# Altium schematic sheet SH-C30G-V1.5.SchDoc
size 420 x 298 mm; Symbol: Sheet-Symbol_A3; Company: DSD TECH; @Page No: 1; @Page Name: P1; @Project Name: CANable; @Page Count: 1; @Update Date: 2023-04-11; @Create Date: 2023-04-11; @Schematic Name: CANableIsolate_V1.4; Device: Sheet-Symbol_A3; @Board Name: CANable_Isolated_SH-C30G_V1.4; @Create Time: 18:08:01; @Update Time: 18:43:36
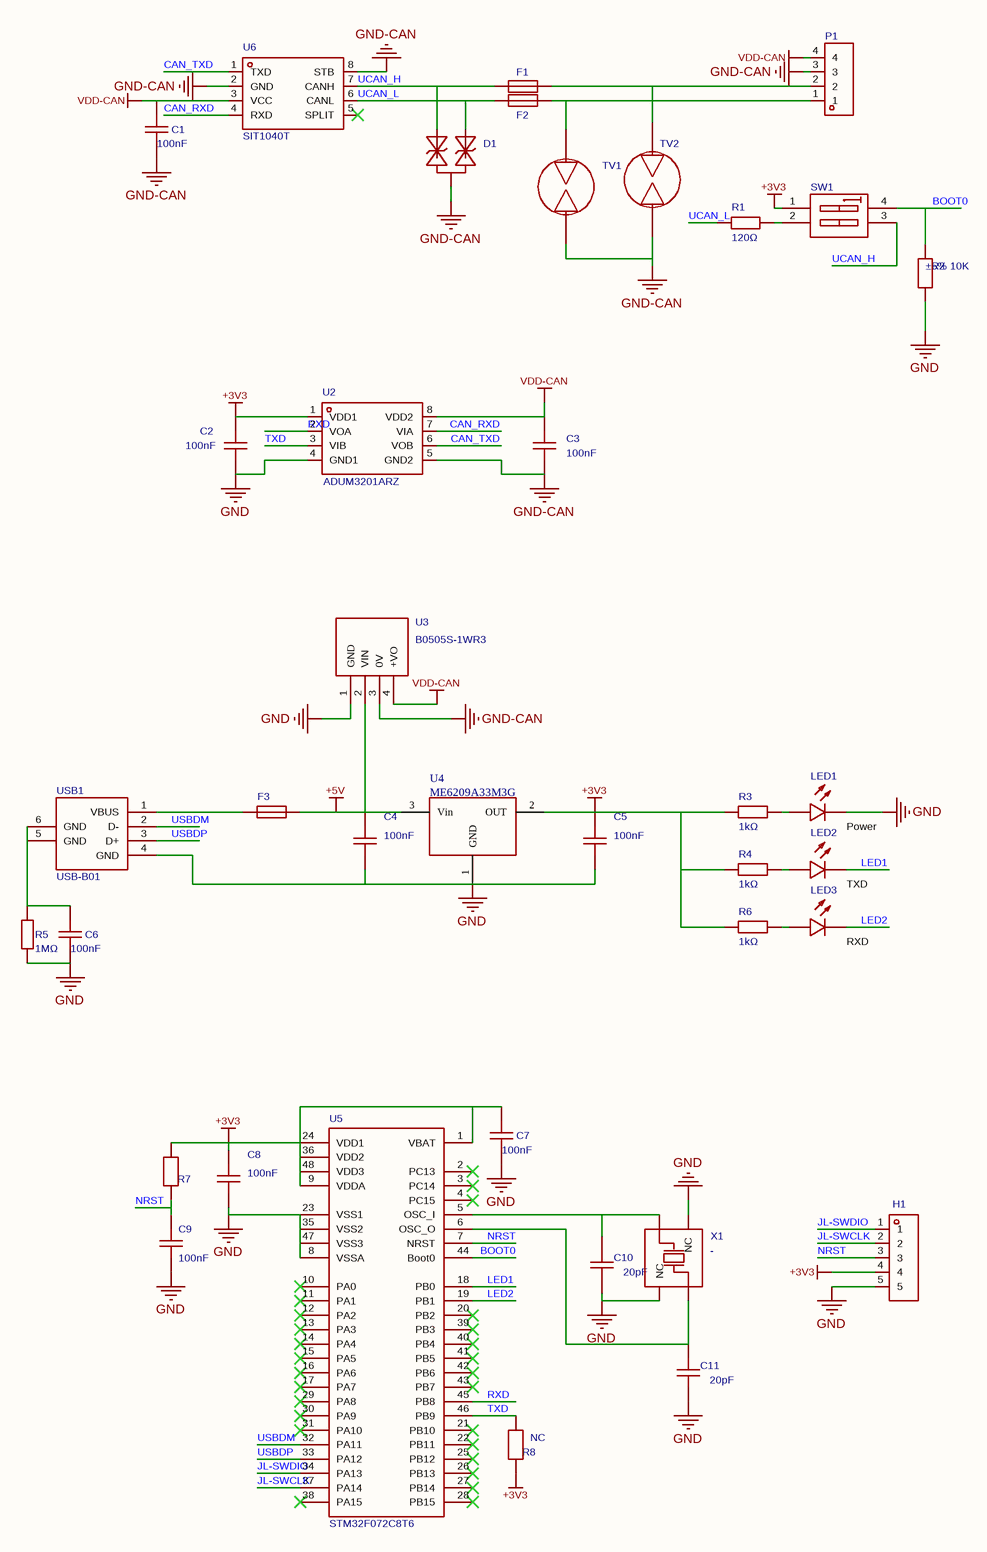
[diagram p0: SH-C30G-V1.5.SchDoc]

## Parts
C1  value 100nF  [C0402]
C2  value 100nF  [C0402]
C3  value 100nF  [C0402]
C4  value 100nF  [C0402]
C5  value 100nF  [C0402]
C6  value 100nF  [C0402]
C7  value 100nF  [C0402]
C8  value 100nF  [C0402]
C9  value 100nF  [C0402]
C10  value 20pF  [C0402]
C11  value 20pF  [C0402]
D1  (no value)  [SOT-23-3_L2.9-W1.3-P1.90-LS2.4-BR]
F1  SMD1206B020TF/24  [F1206_1]  (value not drawn)
F2  SMD1206B020TF/24  [F1206_1]  (value not drawn)
F3  SMD0805B050TF  [F0805_2]  (value not drawn)
H1  (no value)  [HDR-TH_5P-P2.54-V-M]
LED1  (no value)  [LED0603-RD_RED_1]
LED2  (no value)  [LED0603-RD]
LED3  (no value)  [LED0603-RD]
P1  WJ128V-5.0-4P  [CONN-TH_4P-P5.00_WJ128V-4P-5.0-14-00A]  (value not drawn)
R1  value 120Ω  [R0805]
R2  LCSC Part Name: ±5% 10K  [R0402]
R3  value 1kΩ  [R0402]
R4  value 1kΩ  [R0402]
R5  value 1MΩ  [R0603]
R6  value 1kΩ  [R0402]
R7  (no value)  [R0402]
R8  NC  [R0402]
SW1  DP-02RP  [SW-TH_DP-02XP]  (value not drawn)
TV1  (no value)  [DIO-DT-SMD_L4.5-W3.2]
TV2  (no value)  [DIO-DT-SMD_L4.5-W3.2]
U2  ADUM3201ARZ  [SOIC-8_L4.9-W3.9-P1.27-LS6.0-BL]
U3  Manufacturer Part: B0505S-1WR3  [PWRM-TH_B0503S-1WR2]  (hidden comment: B0505S-1WR3_C131038)
U4  ME6209A33M3G  [SOT-23(SOT-23-3)]
U5  (no value)  [LQFP-48_L7.0-W7.0-P0.50-LS9.0-BL]
U6  SIT1040T  [SO-8_L4.9-W3.9-P1.27-LS5.9-BL]
USB1  (no value)  [USB-B-TH_USB-B01]
X1  7V24000005  [CRYSTAL-SMD_4P-L3.2-W2.5-BL]  (value not drawn)

## Nets
+3V3: C2.2 C5.2 C7.2 C8.2 H1.4 R3.1 R4.1 R6.1 R7.2 R8.1 SW1.1(A1) U2.1(VDD1) U4.2(OUT) U5.1(VBAT) U5.9(VDDA) U5.24(VDD1) U5.36(VDD2) U5.48(VDD3)
+5V: C4.2 F3.2 U3.2(VIN) U4.3(Vin)
GND: C2.1 C4.1 C5.1 C6.1 C7.1 C8.1 C9.1 C10.2 C11.1 H1.5 LED1.1(K) R2.1 R5.1 U2.4(GND1) U3.1(GND) U4.1(GND) U5.8(VSSA) U5.23(VSS1) U5.35(VSS2) U5.47(VSS3) USB1.4(GND) X1.2(NC) X1.4(NC)
GND-CAN: C1.1 C3.1 D1.3 P1.3 TV1.2 TV2.2 U2.5(GND2) U3.3(0V) U6.2(GND) U6.8(STB)
VDD-CAN: C1.2 C3.2 P1.4 U2.8(VDD2) U3.4(+VO) U6.3(VCC)
BOOT0: R2.2 SW1.4 U5.44(Boot0)
CAN_RXD: U2.7(VIA) U6.4(RXD)
CAN_TXD: U2.6(VOB) U6.1(TXD)
JL-SWCLK: H1.2 U5.37(PA14)
JL-SWDIO: H1.1 U5.34(PA13)
LED1: LED2.1(K) U5.18(PB0)
LED2: LED3.1(K) U5.19(PB1)
NRST: C9.2 H1.3 R7.1 U5.7(NRST)
RXD: U2.2(VOA) U5.45(PB8)
TXD: R8.2 U2.3(VIB) U5.46(PB9)
UCAN_H: D1.2 F1.1 SW1.3 U6.7(CANH)
UCAN_L: D1.1 F2.1 R1.1 U6.6(CANL)
USBDM: U5.32(PA11) USB1.2(D-)
USBDP: U5.33(PA12) USB1.3(D+)
NetC6_2: C6.2 R5.2 USB1.5(GND) USB1.6(GND)
NetC10_1: C10.1 U5.5(OSC_I) X1.1(OSC1)
NetC11_2: C11.2 U5.6(OSC_O) X1.3(OSC2)
NetF1_2: F1.2 P1.2 TV2.1
NetF2_2: F2.2 P1.1 TV1.1
NetF3_1: F3.1 USB1.1(VBUS)
NetLED1_2: LED1.2(A) R3.2
NetLED2_2: LED2.2(A) R4.2
NetLED3_2: LED3.2(A) R6.2
NetR1_2: R1.2 SW1.2(A2)

Not connected (* = marked no-connect by the designer): U5 2(PC13)* 3(PC14)* 4(PC15)* 10(PA0)* 11(PA1)* 12(PA2)* 13(PA3)* 14(PA4)* 15(PA5)* 16(PA6)* 17(PA7)* 20(PB2)* 21(PB10)* 22(PB11)* 25(PB12)* 26(PB13)* 27(PB14)* 28(PB15)* 29(PA8)* 30(PA9)* 31(PA10)* 38(PA15)* 39(PB3)* 40(PB4)* 41(PB5)* 42(PB6)* 43(PB7)*; U6 5(SPLIT)*

## Notes on the sheet
- (near LED1) Power
- (near LED2) TXD
- (near LED3) RXD
- Update Date
- 2023-04-11
- Schematic
- Page
- P1
- CANableIsolate_V1.4
- Create Date
- Part Number
- Reviewed
- Drawed
- CANable
- VER
- SIZE
- PAGE
- 1
- DSD TECH
- OF

## Library data of the parts
C1-C9 = C0402X104K050T: Capacitance:100nF;Tolerance:±10%;Rated Voltage:50V;Temp. Coefficient:X7R;; Manufacturer: IHHEC; AddInBom: yes; ModelId: 36a51122f27c49738f86b3bfa98863e0; ModelName: C0402_L1.0-W0.5-H0.5; ModelTransform: 39.37,19.685,0,0,0,0,0,0,0; Tolerance: ±10%; Voltage Rated: 50V; Temperature Coefficient: X7R; Device: C0402X104K050T; Symbol: C0402X104K050T; LCSC Part Name: 100nF ±10% 50V; SupplierPart: C501838; ManufacturerPart: C0402X104K050T; Supplier Footprint: 0402; JLCPCB Part Class: Extended Part; Datasheet: https://atta.szlcsc.com/upload/public/pdf/source/20190313/C374174_331C86E4A68CC9C732DA87186AAF7F8A.pdf; Supplier: LCSC; ConvertToPcb: yes; FootprintName: C0402
C10 C11 = GRM1555C1H200JA01D: Capacitance:20pF;Tolerance:±5%;Rated Voltage:50V;Temp. Coefficient:C0G;; Manufacturer: muRata; AddInBom: yes; ModelId: 36a51122f27c49738f86b3bfa98863e0; ModelName: C0402_L1.0-W0.5-H0.5; ModelTransform: 39.37,19.685,0,0,0,0,0,0,0; Tolerance: ±5%; Voltage Rated: 50V; Temperature Coefficient: C0G; Device: GRM1555C1H200JA01D; Symbol: GRM1555C1H200JA01D; LCSC Part Name: 20pF ±5% 50V; SupplierPart: C76959; ManufacturerPart: GRM1555C1H200JA01D; Supplier Footprint: 0402; JLCPCB Part Class: Extended Part; Datasheet: https://atta.szlcsc.com/upload/public/pdf/source/20180307/C76959_15204091273971407747.pdf; Supplier: LCSC; ConvertToPcb: yes; FootprintName: C0402
D1 = TPPESD12VL2BT: Manufacturer: TECH PUBLIC; AddInBom: yes; ModelId: c62791f0466c4ae2a892c056b845b0ca; ModelName: SOT-23-3P_L2.9-W1.3-H1.0-LS2.4-P0.95; ModelTransform: 98.425,114.173,0,180,0,0,0.0005,-0.0005,0; Device: TPPESD12VL2BT; Symbol: TPPESD12VL2BT; LCSC Part Name: TPPESD12VL2BT; SupplierPart: C2682273; ManufacturerPart: TPPESD12VL2BT; Supplier Footprint: SOT-23-3; JLCPCB Part Class: Extended Part; Datasheet: https://atta.szlcsc.com/upload/public/pdf/source/20210810/22D0EE7AE03C1C968B9C50DDF599EB08.pdf; Supplier: LCSC; ConvertToPcb: yes; FootprintName: SOT-23-3_L2.9-W1.3-P1.90-LS2.4-BR
F1 F2 = SMD1206B020TF/24: Max Voltage:24V;Max Current:100A;Hold Current:200mA;Trip Current:420mA;Max Trip Time:100ms;; Manufacturer: Brightking; AddInBom: yes; ModelId: f1628daad26847a79b887277a2bc8541; ModelName: F1206_L3.2-W1.7-H0.6; ModelTransform: 125.984,66.929,0,0,0,0,0,0,0; Operating Voltage (Max): 24V; Current Rating (Max): 100A; Hold Current: 200mA; Trip Current: 420mA; Maximum Time to Trip: 100ms; Device: SMD1206B020TF/24; Symbol: SMD1206B020TF/24; LCSC Part Name: 24VDC 0.2A; SupplierPart: C269111; ManufacturerPart: SMD1206B020TF/24; Supplier Footprint: SMD; JLCPCB Part Class: Extended Part; Datasheet: https://atta.szlcsc.com/upload/public/pdf/source/20180817/C269111_B76553ADDD05C0EABB0A26C6D9A96E77.pdf; Supplier: LCSC; ConvertToPcb: yes; FootprintName: F1206_1
F3 = SMD0805B050TF: Max Voltage:6V;Max Current:100A;Hold Current:500mA;Trip Current:1A;Max Trip Time:100ms;; Manufacturer: Brightking; AddInBom: yes; ModelId: 57e2aa106f9143e8b6ab832aebb31c78; ModelName: F0805_L2.1-W1.4-H0.8; ModelTransform: 82.677,55.118,0,0,0,0,0.0005,0,0; Operating Voltage (Max): 6V; Current Rating (Max): 100A; Hold Current: 500mA; Trip Current: 1A; Maximum Time to Trip: 100ms; Device: SMD0805B050TF; Symbol: SMD0805B050TF; LCSC Part Name: 6V 0.5A; SupplierPart: C269104; ManufacturerPart: SMD0805B050TF; Supplier Footprint: 0805; JLCPCB Part Class: Extended Part; Datasheet: https://atta.szlcsc.com/upload/public/pdf/source/20180814/C269104_466839A5DB65F6E723CA6A162ACE747B.pdf; Supplier: LCSC; ConvertToPcb: yes; FootprintName: F0805_2
H1 = PZ254V-11-05P: Pitch:2.54mm;Total Pins:5;Rows:1;Pin Configuration:1x5P;Row Spacing:-;Mounting Type:Through Hole;Round Pin/Square Pin:Square Pin;Rated Current:-;Rated Voltage:-;Mating Pin Length:6mm;Insulator Height:2.5mm;Termination Pin Length:3mm;Contact Material:Brass;Contact Plating:-;Operating Temp. Range:-40~+105;Color:Black;; Manufacturer: XFCN; AddInBom: yes; ModelId: 47d466e4a34f4fc5bc626cf773a24dd5; ModelName: HDR-TH_5P-P2.54-M-LI-1X5P; ModelTransform: 499.999,100,0,0,0,0,0,0,-118.11; Pitch: 2.54mm; Pin Structure: 1x5P; Operating Temperature Range: -40~+105; Device: PZ254V-11-05P; Symbol: PZ254V-11-05P; LCSC Part Name: 2.54mm 1x5P; SupplierPart: C492404; ManufacturerPart: PZ254V-11-05P; Supplier Footprint: Through Hole,P=2.54mm; JLCPCB Part Class: Extended Part; Datasheet: https://atta.szlcsc.com/upload/public/pdf/source/20200309/C492404_E51533260F8710EFF5D4617281164C1D.pdf; Supplier: LCSC; ConvertToPcb: yes; FootprintName: HDR-TH_5P-P2.54-V-M; Number of Pins: 5; Number of Rows: 1; Row Spacing: -; Mounting Type: Through Hole; Circluar Pins/Square Pins: Square Pin; Current Rating (Max): -; Voltage Rating (Max): -; Length of Mating Pin: 6mm; Insulation Height: 2.5mm; Length of End Connection Pin: 3mm; Contact Material: Brass; Contact Plating: -; Color: Black
LED1 = NCD0603R1_C84263: Emitted Color:Red;; Manufacturer: NationStar; Symbol: FC-DA1608HRK-620D_1; AddInBom: yes; ModelId: 74041d3a270d435c8600a9ab9b7641c0; ModelName: LED0603-RD_RED; ModelTransform: 63.7794,31.496,0,0,0,0,0,0,0; Emitted Color: Red; Device: NCD0603R1_C84263; LCSC Part Name: Red; SupplierPart: C84263; ManufacturerPart: NCD0603R1; Supplier Footprint: 0603; JLCPCB Part Class: Extended Part; Datasheet: https://atta.szlcsc.com/upload/public/pdf/source/20200820/C84263_DABC6A75E58F576973B407FDBA283D60.pdf; Supplier: LCSC; ConvertToPcb: yes; FootprintName: LED0603-RD_RED_1
LED2 LED3 = NCD0603G1: Emitted Color:Emerald Green;; Manufacturer: NationStar; Symbol: FC-D1608UGK-520D10; AddInBom: yes; ModelId: 1f0d29a91be547639d425604e9b96ebb; ModelTransform: 63.7794,32.283,0,0,0,0,0,0,0; Device: NCD0603G1; LCSC Part Name: Emerald Green; SupplierPart: C84267; ManufacturerPart: NCD0603G1; Supplier Footprint: 0603; JLCPCB Part Class: Extended Part; Datasheet: https://atta.szlcsc.com/upload/public/pdf/source/20200820/C84267_04BA7703640BAC111D09F5EFB971FBF3.pdf; Supplier: LCSC; ConvertToPcb: yes; FootprintName: LED0603-RD; ModelName: LED0603-RD; Emitted Color: Emerald Green
P1 = WJ128V-5.0-4P: Pitch:5mm;Rows:1;Pins per Row:4;Mounting:Straight;Rated Current:20A;Rated Voltage:250V;Wire Gauge - AWG:12~22;Wire Gauge - mm?:2.5;Operating Temp. Range:-40℃~+105℃;Color:Green;; Manufacturer: KANGNEX; Symbol: WJ128V-4P-5.0-14-00A; AddInBom: yes; ModelId: cfcf1d8cbec746899afb5ab743e84074; ModelName: CONN-TH_WJ5.00-LI-4P-128; ModelTransform: 807.0748,405.511,0,0,0,0,-7.874,-5.315,-157.48; Pitch: 5mm; Number of PINs Per Row: 4; Current Rating (Max): 20A; Voltage Rating (Max): 250V; Wire Gauge - AWG: 12~22; Wire Gauge - mm?: 2.5; Device: WJ128V-5.0-4P; LCSC Part Name: 5mm Rows:1 Pins per Row:4 Straight stackable; SupplierPart: C192769; ManufacturerPart: WJ128V-5.0-4P; Supplier Footprint: Through Hole,P=5mm; JLCPCB Part Class: Extended Part; Datasheet: https://atta.szlcsc.com/upload/public/pdf/source/20191225/C192769_677B15EBBD9FD2D22E696A4E109D0907.pdf; Supplier: LCSC; ConvertToPcb: yes; FootprintName: CONN-TH_4P-P5.00_WJ128V-4P-5.0-14-00A; Number of Rows: 1; Mounting Style: Straight; Operating Temperature Range: -40℃~+105℃; Color: Green
R1 = TC0525F1200T5E: Resistor Type:Thin Film Resistor;Resistance:120Ω;Tolerance:±1%;Power:250mW;Temp. Coefficient:±25ppm/;Max Working Voltage:150V;Operating Temp. Range:-55~+155;; Manufacturer: UNI-ROYAL; Temperature Coefficient: ±25ppm/; AddInBom: yes; ModelId: 37a81e68749a4138bd2dfa6897b24b85; ModelName: R0805_L2.0-W1.3-H0.6; ModelTransform: 78.74,51.181,0,0,0,0,0,-0.0005,0; Tolerance: ±1%; Power(Watts): 250mW; Overload Voltage (Max): 150V; Operating Temperature Range: -55~+155; Device: TC0525F1200T5E; Symbol: TC0525F1200T5E; LCSC Part Name: 120Ω ±1%; SupplierPart: C61683; ManufacturerPart: TC0525F1200T5E; Supplier Footprint: 0805; JLCPCB Part Class: Extended Part; Datasheet: https://atta.szlcsc.com/upload/public/pdf/source/20190404/C61683_83EF7BF6E2DB2C00969A8D3769A56445.pdf; Supplier: LCSC; ConvertToPcb: yes; FootprintName: R0805; Type: Thin Film Resistor
R2 R7 R8 = SCR0402J10K: Manufacturer: VO; AddInBom: yes; ModelId: 671aefced39d4c318694bba8bd8efd39; ModelName: R0402_L1.0-W0.5-H0.5; ModelTransform: 39.37,19.685,0,0,0,0,0,0.0005,0; Device: SCR0402J10K; Symbol: SCR0402J10K; SupplierPart: C3017497; ManufacturerPart: SCR0402J10K; Supplier Footprint: 0402; JLCPCB Part Class: Extended Part; Datasheet: https://atta.szlcsc.com/upload/public/pdf/source/20220513/247AF9639BA21CF93567DC289CCC6A22.pdf; Supplier: LCSC; ConvertToPcb: yes; FootprintName: R0402
  R7 R8: LCSC Part Name: ±5% 10K
R3 R4 R6 = RC0402JR-071KL: Resistance:1kΩ;Tolerance:±5%;Power:1/16W;Temp. Coefficient:±100ppm/;Max Working Voltage:50V;Operating Temp. Range:-55~+155;; Manufacturer: YAGEO; AddInBom: yes; ModelId: 671aefced39d4c318694bba8bd8efd39; ModelName: R0402_L1.0-W0.5-H0.5; ModelTransform: 39.37,19.685,0,0,0,0,0,0.0005,0; Tolerance: ±5%; Power(Watts): 1/16W; Overload Voltage (Max): 50V; Device: RC0402JR-071KL; Temperature Coefficient: ±100ppm/; Operating Temperature Range: -55~+155; Symbol: RC0402JR-071KL; LCSC Part Name: 1kΩ ±5%; SupplierPart: C105637; ManufacturerPart: RC0402JR-071KL; Supplier Footprint: 0402; JLCPCB Part Class: Extended Part; Datasheet: https://atta.szlcsc.com/upload/public/pdf/source/20170518/1495085707603.pdf; Supplier: LCSC; ConvertToPcb: yes; FootprintName: R0402
R5 = 0603WAJ0105T5E: Resistor Type:Thick Film Resistor;Resistance:1MΩ;Tolerance:±5%;Power:1/10W;Temp. Coefficient:±100ppm/;Max Working Voltage:75V;Operating Temp. Range:-55~+155;; Manufacturer: UNI-ROYAL; AddInBom: yes; ModelId: 3281a289d46d4bb1877be1eabd090e13; ModelName: R0603_L1.6-W0.8-H0.8; ModelTransform: 62.992,31.496,0,0,0,0,0,0,0; Tolerance: ±5%; Power(Watts): 1/10W; Overload Voltage (Max): 75V; Temperature Coefficient: ±100ppm/; Operating Temperature Range: -55~+155; Device: 0603WAJ0105T5E; Symbol: 0603WAJ0105T5E; LCSC Part Name: 1MΩ ±5%; SupplierPart: C26098; ManufacturerPart: 0603WAJ0105T5E; Supplier Footprint: 0603; JLCPCB Part Class: Extended Part; Datasheet: https://atta.szlcsc.com/upload/public/pdf/source/20200306/C422600_1E6D84923E4A46A82E41ADD87F860B5C.pdf; Supplier: LCSC; ConvertToPcb: yes; FootprintName: R0603; Type: Thick Film Resistor
SW1 = DP-02RP: Type:Piano Key;Rated Current:25mA;Rated Voltage:24V;Circuit:SPST;Positions:2;Pin Pitch:2.54mm;Operating Temp.:-20℃~+70℃;Service Life:3000;Color:Red;; Manufacturer: HRO; AddInBom: yes; ModelId: f5e453c164544a96b2961ad153ad33d6; ModelName: SW-TH_DP-02XP-L6.5-W12.4-H9.7-P2.54; ModelTransform: 257.4798,488.188,0,0,0,0,0,-33.583,-157.48; Current Rating: 25mA; Voltage Rating: 24V; Circuit: SPST; Number of Positions: 2; Operating Life: 3000; Device: DP-02RP; Symbol: DP-02RP; LCSC Part Name: Red 2-position 2.54mm through-hole side-actuated DIP switch; SupplierPart: C129041; ManufacturerPart: DP-02RP; Supplier Footprint: Through Hole; JLCPCB Part Class: Extended Part; Datasheet: https://atta.szlcsc.com/upload/public/pdf/source/20210810/79AA2E1F6EDC519505AF8DF4F29ADEEB.pdf; Supplier: LCSC; ConvertToPcb: yes; FootprintName: SW-TH_DP-02XP; Type: Piano Key; Lead Pitch: 2.54mm; Operating Temperature: -20℃~+70℃; Color: Red
TV1 TV2 = SMD4532-090NF: Electrodes:2;DC Breakdown Voltage:90V;Tolerance:±30%;Pulse Discharge Current:3kA;Interelectrode Capacitance:0.5pF;; Manufacturer: RUILON; AddInBom: yes; ModelId: 3e98048e62f042eda67deea78d2be460; ModelName: DIO-DT_L4.5-W3.2-H2.7; ModelTransform: 177.2,126,0,0,0,0,0,0,0; Number of Poles: 2; DC Spark-over Voltage: 90V; Tolerance: ±30%; Nominal Impulse Discharge Current: 3kA; Maximum Capacitance @ 1MHz: 0.5pF; Device: SMD4532-090NF; Symbol: SMD4532-090NF; LCSC Part Name: 90V; SupplierPart: C9235; ManufacturerPart: SMD4532-090NF; Supplier Footprint: 1812; JLCPCB Part Class: Extended Part; Datasheet: https://atta.szlcsc.com/upload/public/pdf/source/20140725/1457707194440.pdf; Supplier: LCSC; ConvertToPcb: yes; FootprintName: DIO-DT-SMD_L4.5-W3.2
U2 = ADUM3201ARZ: Application:-;Isolation Technology:-;Voltage Isolation:-;; Manufacturer: ADI / LINEAR; AddInBom: yes; ModelId: e81d2f7d937b4a6ab1dca543ff5d56a4; ModelName: SOIC-8_L4.9-W3.9-H1.7-LS6.0-P1.27; ModelTransform: 189.751,236.22,0,0,0,0,0.0005,0.0005,0; Manufacturer Part: ADUM3201ARZ; Device: ADUM3201ARZ; Symbol: ADUM3201ARZ; LCSC Part Name: ADUM3201ARZ; SupplierPart: C660765; Supplier Footprint: SOIC-8; JLCPCB Part Class: Extended Part; Datasheet: https://atta.szlcsc.com/upload/public/pdf/source/20180524/C208140_3A204B629C98CB85777430D6F21BA479.pdf; Supplier: LCSC; ConvertToPcb: yes; FootprintName: SOIC-8_L4.9-W3.9-P1.27-LS6.0-BL; Applications: -; Isolation Technology: -; Voltage Isolation or Not: -
U3 = B0505S-1WR3_C131038: Conversion Type:DC-DC;Isolated Regulation:Isolated, unregulated;Number of Outputs:1;Input Voltage (DC):4.5V~5.5V;Output Voltage:5V;Output Current (max):200mA;Output Power:1W;Conversion Efficiency:82%;Characteristics:Short-Circuit Protection;Max Capacitive Load:-;; Manufacturer: MORNSUN; Symbol: B0505S-1WR3_1; AddInBom: yes; ModelId: d17bf056fb5b4095b162347dac51799f; ModelName: PWRM-TH_L11.6-W6.0-H10.2-P2.54; ModelTransform: 456.692,236.259,0,0,0,0,0,82.795,-137.795; Conversion Type: DC-DC; Output Channel: 1; Output Voltage: 5V; Output Current (Max): 200mA; Output Power: 1W; Conversion Efficiency: 82%; Device: B0505S-1WR3_C131038; LCSC Part Name: Vin=4.5V~5.5V Vout=5V 200mA; SupplierPart: C131038; Supplier Footprint: Through Hole; JLCPCB Part Class: Extended Part; Datasheet: https://atta.szlcsc.com/upload/public/pdf/source/20170919/C131038_1505787247657976982.pdf; Supplier: LCSC; ConvertToPcb: yes; FootprintName: PWRM-TH_B0503S-1WR2; Function: -; Isolated Or Voltage Regulation: Isolated, unregulated; Input Voltage(DC): 4.5V~5.5V; Feature: Short-Circuit Protection; Maximum Capacitive Load: -
U4 = ME6209A33M3G: ConvertToPcb: yes; Origin Footprint: SOT-23(SOT-23-3); Device: ME6209A33M3G; Symbol: ME6209A33M3G; AddInBom: yes
U5 = STM32F072C8T6: CPU Core:ARM® Cortex®-M0;Supply Voltage:1.65V ~ 3.6V;; Manufacturer: ST; AddInBom: yes; ModelId: 093be70396ff421eb2cdb946d5311efc; ModelName: LQFP-48_L7.0-W7.0-H1.4-LS9.0-P0.50; ModelTransform: 354.331,354.331,0,0,0,0,0,0,0; Program Memory Size: 64KB; RAM Size: 16KB; Number of I/O: 37; A/D: 10x12bit; D/A: 2x12bit; PWM: 6; UART/USART: 4 USART; I2C (SMBUS/PMBUS): 2; USB Device: 1; Manufacturer Part: STM32F072C8T6; Device: STM32F072C8T6; Symbol: STM32F072C8T6; LCSC Part Name: STM32F072C8T6; SupplierPart: C80488; Supplier Footprint: LQFP-48_7x7x05P; JLCPCB Part Class: Extended Part; Datasheet: https://atta.szlcsc.com/upload/public/pdf/source/20160816/1471343013459.pdf; Supplier: LCSC; ConvertToPcb: yes; FootprintName: LQFP-48_L7.0-W7.0-P0.50-LS9.0-BL; Core Processor: ARM® Cortex®-M0; Voltage - Supply (Vcc/Vdd): 1.65V ~ 3.6V; CAN: 1; Features: I2S,HDMI CEC
U6 = SIT1040T: Type:Transceiver;Data Rate:1Mbps;Supply Voltage (Vcc):4.5V~5.5V;; Manufacturer: SIT; AddInBom: yes; ModelId: 756fba4e187a48c69a2c935cd5c4465b; ModelName: SO-8_L4.9-W3.9-H1.5-LS5.9-P1.27; ModelTransform: 240.39054,192.913,0,270,0,0,0.0005,-0.0005,0; Data Rate: 1Mbps; Manufacturer Part: SIT1040T; Device: SIT1040T; Symbol: SIT1040T; LCSC Part Name: SIT1040T; SupplierPart: C381512; Supplier Footprint: SO-8; JLCPCB Part Class: Extended Part; Datasheet: https://atta.szlcsc.com/upload/public/pdf/source/20190522/C381512_C4B6850414C3DC7255C6595ED19047C9.pdf; Supplier: LCSC; ConvertToPcb: yes; FootprintName: SO-8_L4.9-W3.9-P1.27-LS5.9-BL; Type: Transceiver; Supply Voltage: 4.5V~5.5V
USB1 = USB-B01: Connector Type:Type-B;Standard:USB 2.0;Gender:receptacle;Contacts:4;Ports:1;Mounting:Right-angle through hole;Rated Current - Power:-;Operating Temp. Range:-;; Manufacturer: SOFNG; AddInBom: yes; ModelId: 114ce80f03154dcc9f53637e65f34174; ModelTransform: 570.9,651.6,0,180,0,0,0,177.2,-137.8; Connector Type: Type-B; Number of Contacts: 4; Number of Ports: 1; Manufacturer Part: USB-B01; Device: USB-B01; Symbol: USB-B01; LCSC Part Name: Type-B receptacle Right-angle through hole; SupplierPart: C498173; Supplier Footprint: Through Hole; JLCPCB Part Class: Extended Part; Datasheet: https://atta.szlcsc.com/upload/public/pdf/source/20200812/C498173_CFDA774068C8841191F9DEBD85971FB5.pdf; Supplier: LCSC; ConvertToPcb: yes; FootprintName: USB-B-TH_USB-B01; ModelName: USB-B-TH_USB-B01; Standard: USB 2.0; Gender: receptacle; Mounting Style: Right-angle through hole; Current Rating - Power (Max): -; Operating Temperature Range: -
X1 = 7V24000005: Crystal Type:-;Frequency:-;Load Capacitance:-;Operating Temp.:-;; Manufacturer: TXC; Symbol: 7V2405LCSC-EEC4G; AddInBom: yes; ModelId: 1840cb1b89674ca18acb69eedbab271b; ModelName: OSC-SMD_4P-L3.2-W2.5-H1.0; ModelTransform: 125.984,98.425,0,0,0,0,0,0,0; Value: -; Device: 7V24000005; LCSC Part Name: XTAL G3225 24M 9pF 10ppm 50R -20~70℃; SupplierPart: C90928; ManufacturerPart: 7V24000005; Supplier Footprint: SMD3225-4P; JLCPCB Part Class: Extended Part; Datasheet: https://atta.szlcsc.com/upload/public/pdf/source/20161217/1481939203082.pdf; Supplier: LCSC; ConvertToPcb: yes; FootprintName: CRYSTAL-SMD_4P-L3.2-W2.5-BL; Crystal Type: -; Load Capacitance: -; Operating Temperature: -